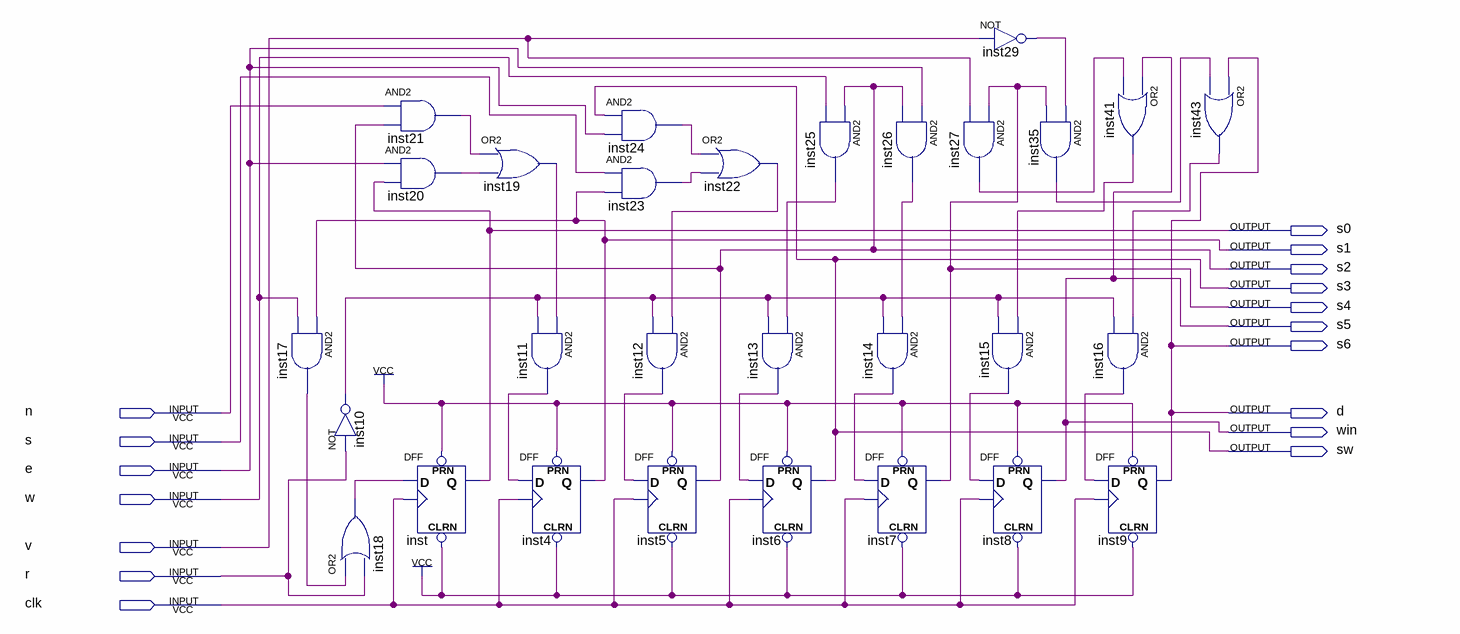
[diagram p0: schematic sheet]
// Quartus schematic room.bdf as structural Verilog: 29 symbols, 17 pins
module room (
  input  n,
  input  s,
  input  e,
  input  w,
  input  v,
  input  r,
  input  clk,
  output s0,
  output s1,
  output s2,
  output s3,
  output s4,
  output s5,
  output s6,
  output d,
  output win,
  output sw
);

  wire inst10_out, inst11_out, inst12_out, inst13_out, inst14_out, inst15_out, inst16_out, inst17_out,
       inst18_out, inst19_out, inst20_out, inst21_out, inst22_out, inst23_out, inst24_out, inst25_out,
       inst26_out, inst27_out, inst29_out, inst35_out, inst41_out, inst43_out;

  and inst17 (inst17_out, s1, w);
  and inst21 (inst21_out, n, s2);
  and inst20 (inst20_out, e, s0);
  not inst10 (inst10_out, r);
  or inst18 (inst18_out, inst17_out, r);
  DFF inst (.CLRN(1'b1), .CLK(clk), .D(inst18_out), .PRN(1'b1), .Q(s0));
  or inst19 (inst19_out, inst21_out, inst20_out);
  and inst11 (inst11_out, inst19_out, inst10_out);
  DFF inst4 (.CLRN(1'b1), .CLK(clk), .D(inst11_out), .PRN(1'b1), .Q(s1));
  and inst24 (inst24_out, s3, e);
  and inst23 (inst23_out, s, s1);
  and inst12 (inst12_out, inst22_out, inst10_out);
  DFF inst5 (.CLRN(1'b1), .CLK(clk), .D(inst12_out), .PRN(1'b1), .Q(s2));
  or inst22 (inst22_out, inst24_out, inst23_out);
  and inst13 (inst13_out, inst25_out, inst10_out);
  DFF inst6 (.CLRN(1'b1), .CLK(clk), .D(inst13_out), .PRN(1'b1), .Q(s3));
  and inst25 (inst25_out, s2, w);
  and inst26 (inst26_out, e, s2);
  and inst14 (inst14_out, inst26_out, inst10_out);
  DFF inst7 (.CLRN(1'b1), .CLK(clk), .D(inst14_out), .PRN(1'b1), .Q(s4));
  not inst29 (inst29_out, v);
  and inst27 (inst27_out, s4, v);
  and inst15 (inst15_out, inst41_out, inst10_out);
  DFF inst8 (.CLRN(1'b1), .CLK(clk), .D(inst15_out), .PRN(1'b1), .Q(s5));
  and inst35 (inst35_out, inst29_out, s4);
  or inst41 (inst41_out, s5, inst27_out);
  and inst16 (inst16_out, inst43_out, inst10_out);
  DFF inst9 (.CLRN(1'b1), .CLK(clk), .D(inst16_out), .PRN(1'b1), .Q(d));
  or inst43 (inst43_out, d, inst35_out);

  assign s6 = d;
  assign sw = s3;
  assign win = s5;
endmodule
